# EAGLE design displayadapter (EAGLE 7.2.0)
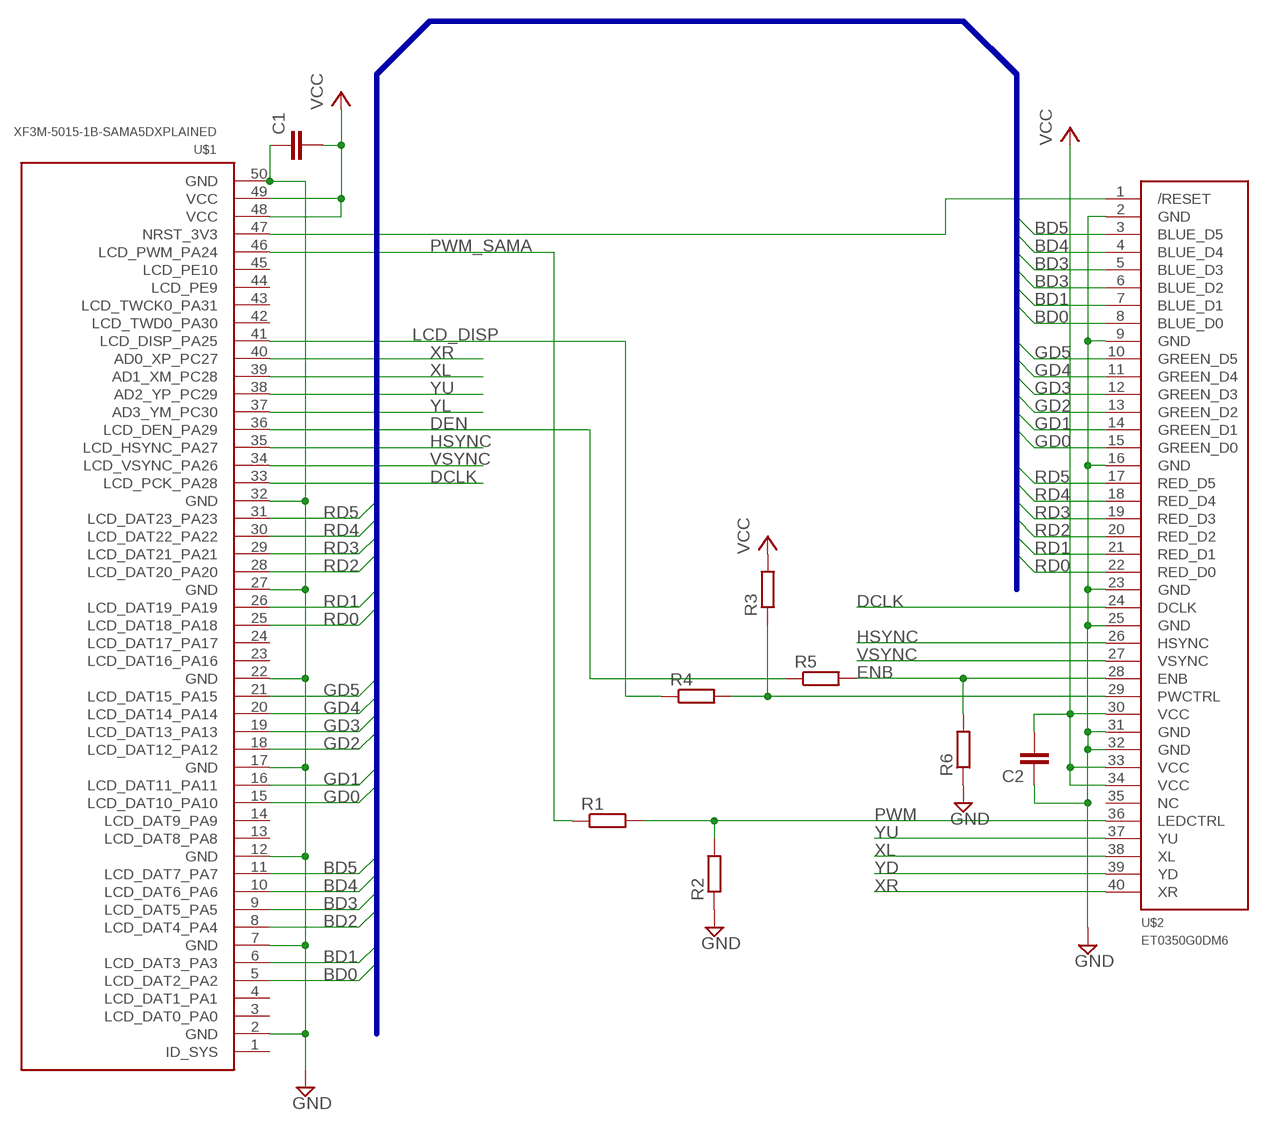
[diagram p0: schematic, sheet 1]

## Parts
C1  C-EUC0805  [C0805]
C2  C-EUC0805  [C0805]
R1  R-EU_M0805  [M0805]
R2  R-EU_M0805  [M0805]
R3  R-EU_M0805  [M0805]
R4  R-EU_M0805  [M0805]
R5  R-EU_M0805  [M0805]
R6  R-EU_M0805  [M0805]
U$1  XF3M-5015-1B-SAMA5DXPLAINED  [XF3M-5015-1B]
U$2  ET0350G0DM6  [XF3M-4015-1B]

## Nets
BD0: U$1.5(LCD_DAT2_PA2) U$2.8(BLUE_D0)
BD1: U$1.6(LCD_DAT3_PA3) U$2.7(BLUE_D1)
BD2: U$1.8(LCD_DAT4_PA4) U$2.6(BLUE_D2)
BD3: U$1.9(LCD_DAT5_PA5) U$2.5(BLUE_D3)
BD4: U$1.10(LCD_DAT6_PA6) U$2.4(BLUE_D4)
BD5: U$1.11(LCD_DAT7_PA7) U$2.3(BLUE_D5)
DCLK: U$1.33(LCD_PCK_PA28) U$2.24(DCLK)
DEN: R5.1 U$1.36(LCD_DEN_PA29)
ENB: R5.2 R6.2 U$2.28(ENB)
GD0: U$1.15(LCD_DAT10_PA10) U$2.15(GREEN_D0)
GD1: U$1.16(LCD_DAT11_PA11) U$2.14(GREEN_D1)
GD2: U$1.18(LCD_DAT12_PA12) U$2.13(GREEN_D2)
GD3: U$1.19(LCD_DAT13_PA13) U$2.12(GREEN_D3)
GD4: U$1.20(LCD_DAT14_PA14) U$2.11(GREEN_D4)
GD5: U$1.21(LCD_DAT15_PA15) U$2.10(GREEN_D5)
GND: C1.1 C2.1 R2.1 R6.1 U$1.2(GND) U$1.7(GND) U$1.12(GND) U$1.17(GND) U$1.22(GND) U$1.27(GND) U$1.32(GND) U$1.50(GND) U$2.2(GND) U$2.9(GND) U$2.16(GND) U$2.23(GND) U$2.25(GND) U$2.31(GND) U$2.32(GND)
HSYNC: U$1.35(LCD_HSYNC_PA27) U$2.26(HSYNC)
LCD_DISP: R4.1 U$1.41(LCD_DISP_PA25)
N$1: R3.1 R4.2 U$2.29(PWCTRL)
N$6: U$1.47(NRST_3V3) U$2.1(/RESET)
PWM: R1.2 R2.2 U$2.36(LEDCTRL)
PWM_SAMA: R1.1 U$1.46(LCD_PWM_PA24)
RD0: U$1.25(LCD_DAT18_PA18) U$2.22(RED_D0)
RD1: U$1.26(LCD_DAT19_PA19) U$2.21(RED_D1)
RD2: U$1.28(LCD_DAT20_PA20) U$2.20(RED_D2)
RD3: U$1.29(LCD_DAT21_PA21) U$2.19(RED_D3)
RD4: U$1.30(LCD_DAT22_PA22) U$2.18(RED_D4)
RD5: U$1.31(LCD_DAT23_PA23) U$2.17(RED_D5)
VCC: C1.2 C2.2 R3.2 U$1.48(VCC) U$1.49(VCC) U$2.30(VCC) U$2.33(VCC) U$2.34(VCC)
VSYNC: U$1.34(LCD_VSYNC_PA26) U$2.27(VSYNC)
XL: U$1.39(AD1_XM_PC28) U$2.38(XL)
XR: U$1.40(AD0_XP_PC27) U$2.40(XR)
YD: U$2.39(YD)
YL: U$1.37(AD3_YM_PC30)
YU: U$1.38(AD2_YP_PC29) U$2.37(YU)
Unconnected: U$1.1(ID_SYS) U$1.3(LCD_DAT0_PA0) U$1.4(LCD_DAT1_PA1) U$1.13(LCD_DAT8_PA8) U$1.14(LCD_DAT9_PA9) U$1.23(LCD_DAT16_PA16) U$1.24(LCD_DAT17_PA17) U$1.42(LCD_TWD0_PA30) U$1.43(LCD_TWCK0_PA31) U$1.44(LCD_PE9) U$1.45(LCD_PE10) U$2.35(NC)

## Buses
B$1

## Library data of the parts
C1 C2 = rcl:C-EU: CAPACITOR, European symbol
R1-R6 = rcl:R-EU_: RESISTOR, European symbol
U$1 = mylib:XF3M-5015-1B-SAMA5DXPLAINED
U$2 = mylib:ET0350G0DM6

## Board
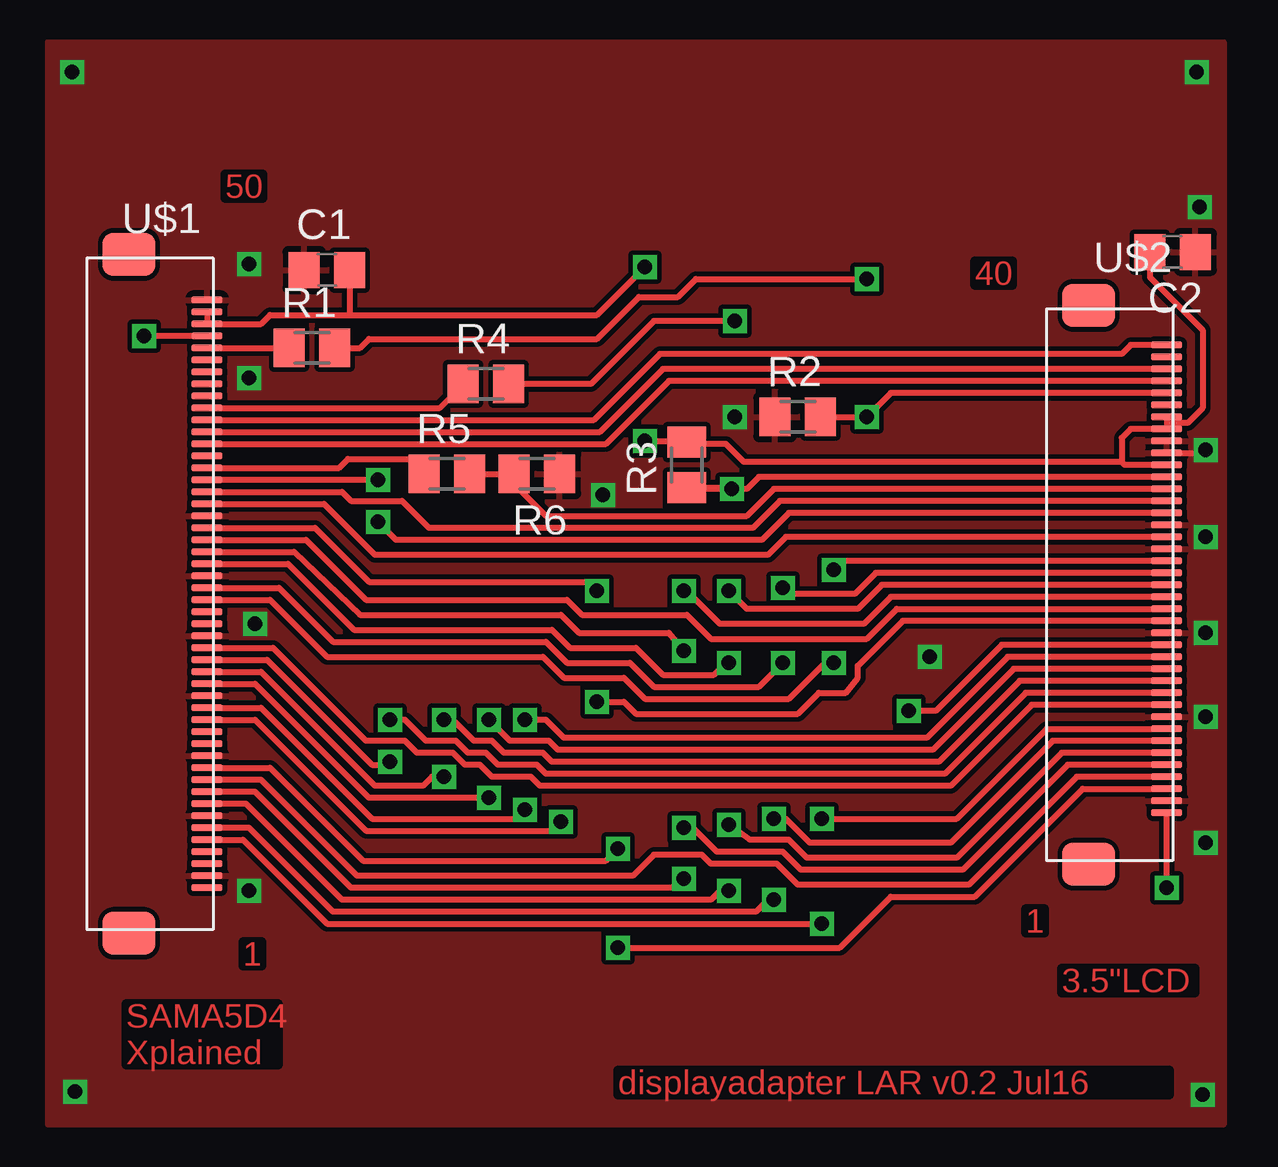
[diagram p1: board, top side]
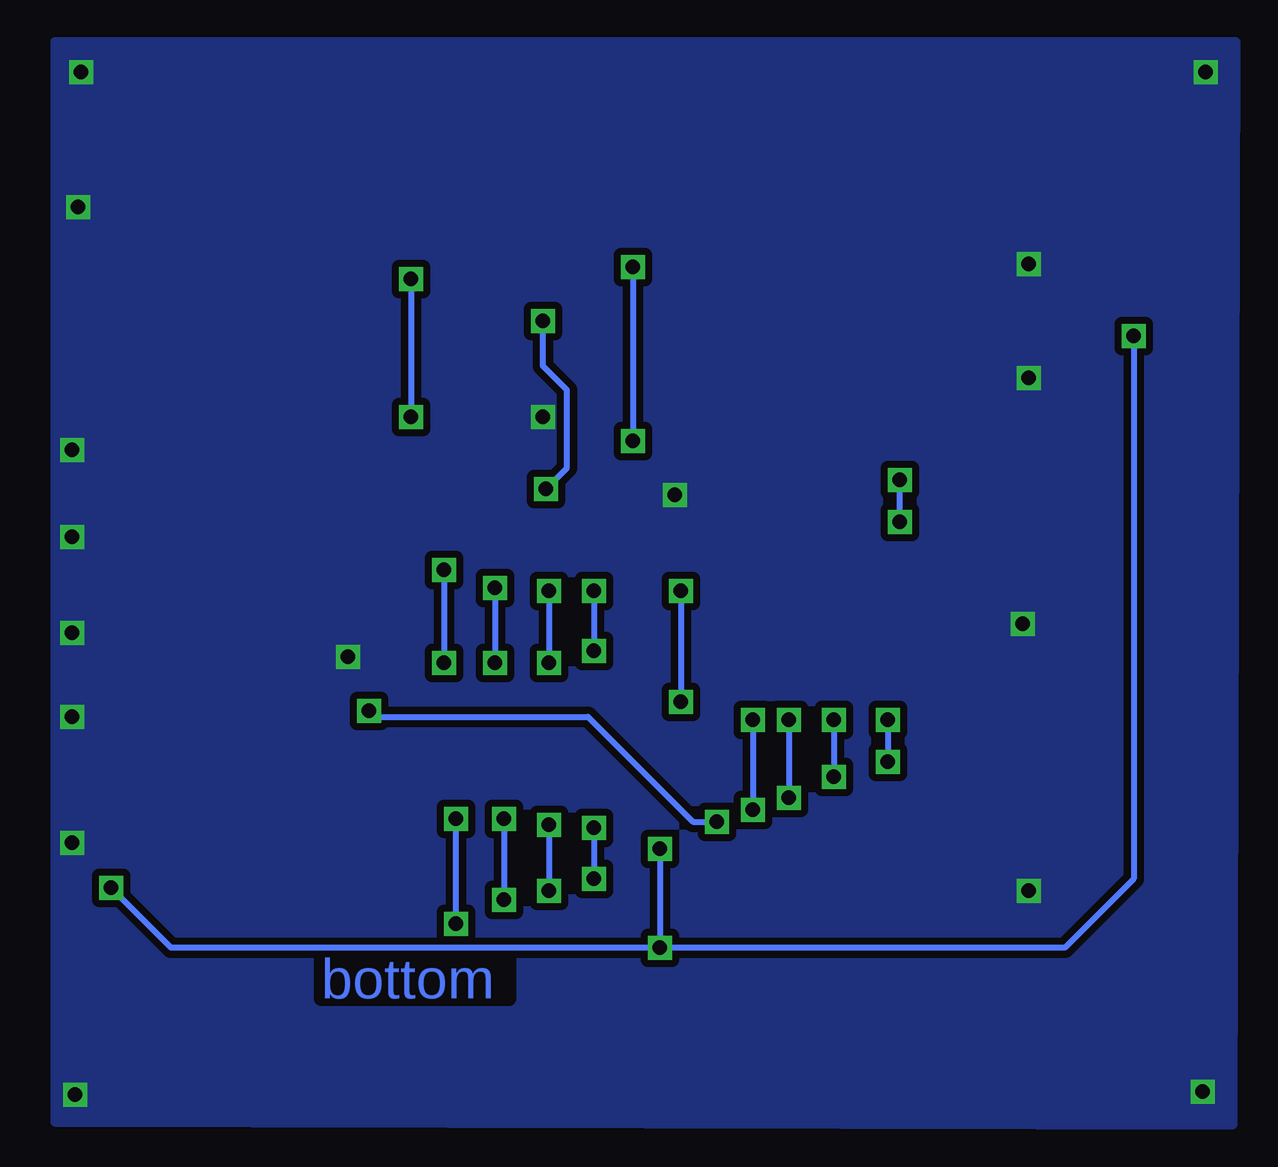
[diagram p2: board, bottom side, seen from below]

No outline drawn. Coordinates in mm, seen from the top.
Copper layers (1*16): Top 0.035mm / dielectric 1.5mm / Bottom 0.035mm
Design rules "default *": minimum track width 0.1mm, minimum drill 24mil, track to track 0.05mm, track to pad 8mil, pad to pad 8mil, via to via 8mil, smd to smd 8mil, copper to edge 40mil, drill to drill 8mil, minimum pad ring 10mil, minimum via ring 8mil, stop-mask expansion 4mil, vias tented up to drill 0mil, thermal gap 10mil

### Footprints (pad centres in the part's own frame; a part is rotated, then mirrored left to right if it is on the bottom)
C0805 = smd 1.3 x 1.5: 1 -0.95,0; 2 0.95,0
M0805 = smd 1.3 x 1.6: 1 -0.95,0; 2 0.95,0
XF3M-5015-1B = smd 1.3 x 0.3: 1 0,12.25; 2 0,11.75; 3 0,11.25; 4 0,10.75; 5 0,10.25; 6 0,9.75; 7 0,9.25; 8 0,8.75; 9 0,8.25; 10 0,7.75; 11 0,7.25; 12 0,6.75; 13 0,6.25; 14 0,5.75; 15 0,5.25; 16 0,4.75; 17 0,4.25; 18 0,3.75; 19 0,3.25; 20 0,2.75; 21 0,2.25; 22 0,1.75; 23 0,1.25; 24 0,0.75; 25 0,0.25; 26 0,-0.25; 27 0,-0.75; 28 0,-1.25; 29 0,-1.75; 30 0,-2.25; 31 0,-2.75; 32 0,-3.25; 33 0,-3.75; 34 0,-4.25; 35 0,-4.75; 36 0,-5.25; 37 0,-5.75; 38 0,-6.25; 39 0,-6.75; 40 0,-7.25; 41 0,-7.75; 42 0,-8.25; 43 0,-8.75; 44 0,-9.25; 45 0,-9.75; 46 0,-10.25; 47 0,-10.75; 48 0,-11.25; 49 0,-11.75; 50 0,-12.25 | smd 2.2 x 1.8: P$51 3.25,14.15; P$52 3.25,-14.15
XF3M-4015-1B = smd 1.3 x 0.3: 1 0,9.5; 2 0,9; 3 0,8.5; 4 0,8; 5 0,7.5; 6 0,7; 7 0,6.5; 8 0,6; 9 0,5.5; 10 0,5; 11 0,4.5; 12 0,4; 13 0,3.5; 14 0,3; 15 0,2.5; 16 0,2; 17 0,1.5; 18 0,1; 19 0,0.5; 20 0,0; 21 0,-0.5; 22 0,-1; 23 0,-1.5; 24 0,-2; 25 0,-2.5; 26 0,-3; 27 0,-3.5; 28 0,-4; 29 0,-4.5; 30 0,-5; 31 0,-5.5; 32 0,-6; 33 0,-6.5; 34 0,-7; 35 0,-7.5; 36 0,-8; 37 0,-8.5; 38 0,-9; 39 0,-9.5; 40 0,-10 | smd 2.2 x 1.8: P$51 3.25,11.65; P$52 3.25,-11.65

### Placement (x,y rotation side)
C1  11.88,35.5 0 top
C2  47.12,36.25 180 top
R1  11.25,32.25 0 top
R2  31.5,29.38 0 top
R3  26.88,27.38 90 top
R4  18.5,30.75 0 top
R5  16.88,27 0 top
R6  20.62,27 180 top
U$1  6.88,22 180 top
U$2  46.88,22.38 180 top

### Tracks (layer width: path | path; a pad name or v marks a point on that pad's centre or on a via)
BD0  (via drill 0.6)
  Top 0.25: U$1.5 8.38,11.75 11.88,8.25 v32.5,8.25 | v32.5,12.62 38.12,12.62 41.88,16.38 U$2.8
  Bottom 0.25: v32.5,8.25 v32.5,12.62
BD1  (via drill 0.6)
  Top 0.25: U$2.7 42.12,15.88 37.88,11.62 32,11.62 31,12.62 v30.5,12.62 | v30.5,9.25 30.25,9.25 29.75,8.75 12.12,8.75 8.62,12.25 U$1.6
  Bottom 0.25: v30.5,12.62 v30.5,9.25
BD2  (via drill 0.6)
  Top 0.25: U$2.6 42.5,15.38 38.12,11 31.88,11 31.12,11.75 29.5,11.75 v28.62,12.38 | v28.62,9.62 28.62,10 27.88,9.25 12.5,9.25 8.5,13.25 U$1.8
  Bottom 0.25: v28.62,12.38 v28.62,9.62
BD3  (via drill 0.6)
  Top 0.25: U$2.5 42.75,14.88 38.38,10.5 31.62,10.5 30.88,11.25 28.12,11.25 27.12,12.25 v26.75,12.25 | v26.75,10.12 26.75,10.25 26.25,9.75 12.88,9.75 8.88,13.75 U$1.9
  Bottom 0.25: v26.75,12.25 v26.75,10.12
BD4
  Top 0.25: U$2.4 43.12,14.38 38.62,9.88 31.5,9.88 30.62,10.75 27.88,10.75 27.5,11.12 25.5,11.12 24.62,10.25 13.12,10.25 9.12,14.25 U$1.10
BD5  (via drill 0.6)
  Top 0.25: U$1.11 9.5,14.75 13.38,10.88 23.5,10.88 v24,11.38 | v24,7.25 33.25,7.25 35.38,9.38 38.88,9.38 43.38,13.88 U$2.3
  Bottom 0.25: v24,11.38 v24,7.25
DCLK
  Top 0.25: U$2.24 31,24.38 30.25,23.62 13.88,23.62 11.75,25.75 U$1.33
DEN
  Top 0.25: 15.68,27.25 R5.1 15.3,27.62 12.75,27.62 12.38,27.25 U$1.36
ENB
  Top 0.25: R5.2 R6.2 19.68,26.57 21,25.25 29.38,25.25 30.5,26.38 U$2.28
GD0  (via drill 0.6)
  Top 0.25: U$2.15 40,19.88 37.25,17.12 v36.12,17.12 | U$1.15 8.88,16.75 13.5,12.12 21.25,12.12 v21.62,12.5
  Bottom 0.25: v36.12,17.12 35.88,16.88 27,16.88 22.62,12.5 v21.62,12.5
GD1  (via drill 0.6)
  Top 0.25: U$2.14 40.25,19.38 36.88,16 21.75,16 21,16.75 v20.12,16.75 | U$1.16 9.12,17.25 13.75,12.62 19.75,12.62 v20.12,13
  Bottom 0.25: v20.12,16.75 v20.12,13 20.25,12.88
GD2  (via drill 0.6)
  Top 0.25: U$2.13 40.5,18.88 37.12,15.5 21.5,15.5 21.12,15.88 19.5,15.88 v18.62,16.75 | U$1.18 8.88,18.25 13.62,13.5 v18.62,13.5
  Bottom 0.25: v18.62,16.75 v18.62,13.5
GD3  (via drill 0.6)
  Top 0.25: U$2.12 40.75,18.38 37.38,15 21.25,15 20.88,15.38 19.25,15.38 18.75,15.88 18,15.88 17.12,16.75 v16.75,16.75 | U$1.19 9.12,18.75 13.88,14 15.88,14 16.25,14.38 v16.75,14.38
  Bottom 0.25: v16.75,16.75 v16.75,14.38
GD4  (via drill 0.6)
  Top 0.25: U$2.11 41,17.88 37.62,14.5 21,14.5 20.62,14.88 19,14.88 18.5,15.38 17.75,15.38 17.25,15.88 16,15.88 15.12,16.75 v14.5,16.75 | U$1.20 9.38,19.25 13.75,14.88 14.38,14.88 v14.5,15
  Bottom 0.25: v14.5,16.75 v14.5,15
GD5
  Top 0.25: U$2.10 41.25,17.38 37.88,14 20.75,14 20.38,14.38 18.75,14.38 18.25,14.88 17.62,14.88 17.12,15.38 15.62,15.38 15.12,15.88 13.5,15.88 9.62,19.75 U$1.21
GND  (via drill 0.6)
  Top 0.25: U$2.31 48.38,27.88 v48.5,28
  other vias: 8.62,35.75 28.88,29.38 23.38,26.12 8.88,20.75 37,19.38 8.62,9.62 48.5,11.62 48.5,16.88 48.5,20.38 48.5,24.38 8.62,31 1.25,43.75 48.12,43.75 48.38,1.12 1.38,1.25 48.25,38.12
  pour Bottom (isolate 0.3): 0,45 49.2,45 49.2,0 0.12,-0.12
  pour Top (isolate 0.2): 0.25,45 49.25,45 49.25,-0.12 0.25,-0.12
HSYNC  (via drill 0.6)
  Top 0.25: U$2.26 31.12,25.38 30,24.25 14.75,24.25 v14,25 | v14,26.75 U$1.35
  Bottom 0.25: v14,25 v14,26.75
LCD_DISP
  Top 0.25: U$1.41 16.57,29.75 R4.1
N$1  (via drill 0.6)
  Top 0.25: U$2.29 29.88,26.88 29.38,26.38 v28.75,26.38 | v28.75,26.38 26.93,26.38 R3.1 28.7,26.43 v28.75,26.38 | v28.88,33.38 25.5,33.38 22.88,30.75 R4.2
  Bottom 0.25: v28.75,26.38 27.88,27.25 27.88,30.5 28.88,31.5 v28.88,33.38
N$6  (via drill 0.6)
  Top 0.25: U$1.47 v4.25,32.75 | v46.88,9.75 U$2.1
  Bottom 0.25: v4.25,32.75 4.25,10.12 7.12,7.25 44.38,7.25 v46.88,9.75
PWM  (via drill 0.6)
  Top 0.25: U$2.36 35.38,30.38 v34.38,29.38 R2.2 | R1.2 13.25,32.25 13.62,32.62 23.12,32.62 24.88,34.38 26.5,34.38 27.25,35.12 v34.38,35.12
  Bottom 0.25: v34.38,35.12 v34.38,29.38
PWM_SAMA
  Top 0.25: U$1.46 R1.1
RD0  (via drill 0.6)
  Top 0.25: U$1.25 9.5,21.75 11.88,19.38 20.88,19.38 21.75,18.5 24.25,18.5 25.12,17.62 31.12,17.62 32.62,19.12 v33,19.12 | U$2.22 33.38,23.38 v33,23
  Bottom 0.25: v33,23 v33,19.12
RD1  (via drill 0.6)
  Top 0.25: U$1.26 9.88,22.25 12.12,20 21,20 21.88,19.12 24.5,19.12 25.5,18.12 29.88,18.12 v30.88,19.12 | U$2.21 34.75,22.88 33.88,22 31.12,22 v30.88,22.25
  Bottom 0.25: v30.88,22.25 v30.88,19.12
RD2  (via drill 0.6)
  Top 0.25: U$1.28 10.25,23.25 13,20.5 21.25,20.5 22,19.75 24.75,19.75 25.88,18.62 28,18.62 28.5,19.12 v28.62,19.12 | U$2.20 35,22.38 34,21.38 29.38,21.38 v28.62,22.12
  Bottom 0.25: v28.62,22.12 v28.62,19.12
RD3  (via drill 0.6)
  Top 0.25: U$1.29 10.5,23.75 13.25,21.12 21.62,21.12 22.38,20.38 26.12,20.38 v26.75,19.62 | U$2.19 35.38,21.88 34.25,20.75 28.25,20.75 26.88,22.12 v26.75,22.12
  Bottom 0.25: v26.75,22.12 v26.75,19.62
RD4
  Top 0.25: U$1.30 11,24.25 13.5,21.75 21.88,21.75 22.5,21.12 26.88,21.12 27.88,20.12 34.38,20.12 35.62,21.38 U$2.18
RD5  (via drill 0.6)
  Top 0.25: U$1.31 11.38,24.75 13.62,22.5 22.75,22.5 v23.12,22.12 | v23.12,17.5 24.25,17.5 24.75,17 31.5,17 32.38,17.88 33.5,17.88 34,18.5 34,19 35.88,20.88 U$2.17
  Bottom 0.25: v23.12,22.12 v23.12,17.5
VCC  (via drill 0.6)
  Top 0.25: 45,27.5 45,28.5 45.38,28.88 U$2.33 | 45,27.5 29.25,27.5 28.5,28.25 27.38,28.25 | 27.38,28.25 26.95,28.25 R3.2 | U$1.49 U$1.48 9.12,33.25 9.5,33.62 12.75,33.62 | 12.75,33.62 23.12,33.62 v25.12,35.62 | v25.12,28.38 27.25,28.38 27.38,28.25 | U$2.34 U$2.33 | U$2.30 45.12,27.38 45,27.5 | C1.2 12.82,33.7 12.75,33.62 | C2.2 46.17,35.2 48.38,33 48.38,29.75 47.75,29.12 47.12,29.12 U$2.33
  Bottom 0.25: v25.12,35.62 v25.12,28.38
VSYNC
  Top 0.25: U$2.27 30.75,25.88 29.62,24.75 16.12,24.75 15,25.88 12.88,25.88 12.5,26.25 U$1.34
XL
  Top 0.25: U$1.39 23.25,28.75 25.88,31.38 U$2.38
XR
  Top 0.25: U$1.40 23,29.25 25.75,32 45,32 45.38,32.38 U$2.40
YU
  Top 0.25: U$2.37 26.12,30.88 23.5,28.25 U$1.38

### Text on the board
Top: 50 | 40 | 1 | 1 | 3.5"LCD | SAMA5D4 / Xplained | displayadapter LAR v0.2 Jul16
Bottom: bottom